# EAGLE design sensor (EAGLE 9.0.1)
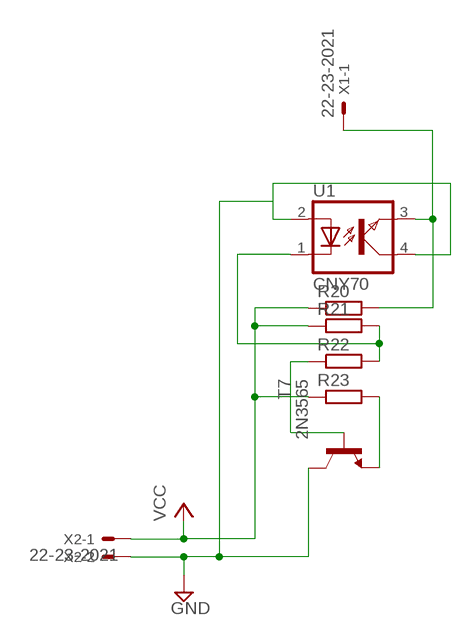
[diagram p0: schematic, sheet 1]

## Parts
R20  R-EU_0204/7  [0204/7]
R21  R-EU_0204/7  [0204/7]
R22  R-EU_0204/7  [0204/7]
R23  R-EU_0204/7  [0204/7]
T7  2N3565  [TO92]
U1  CNY70  [CNY70]
X1  22-23-2021  [22-23-2021]
X2  22-23-2021  [22-23-2021]

## Nets
GND1: T7.1(C) U1.2 U1.4 X2.2
N$1: R23.2 T7.3(E)
N$6: R21.2 R22.2 U1.1
N$8: R20.2 U1.3 X1.1
N$9: R22.1 T7.2(B)
VCC: R20.1 R21.1 R23.1 X2.1
Unconnected: X1.2

## Library data of the parts
R20-R23 = rcl:R-EU_: RESISTOR, European symbol; SPICEPREFIX: R
T7 = transistor:2N3565: NPN TRANSISTOR
U1 = E&R_Sensores:CNY70: Sensor infrarrojo CNY70
X1 X2 = con-molex:22-23-2021: .100" (2.54mm) Center Header - 2 Pin; MF: MOLEX; MPN: 22-23-2021; OC_FARNELL: 1462926; OC_NEWARK: 25C3832

## Board
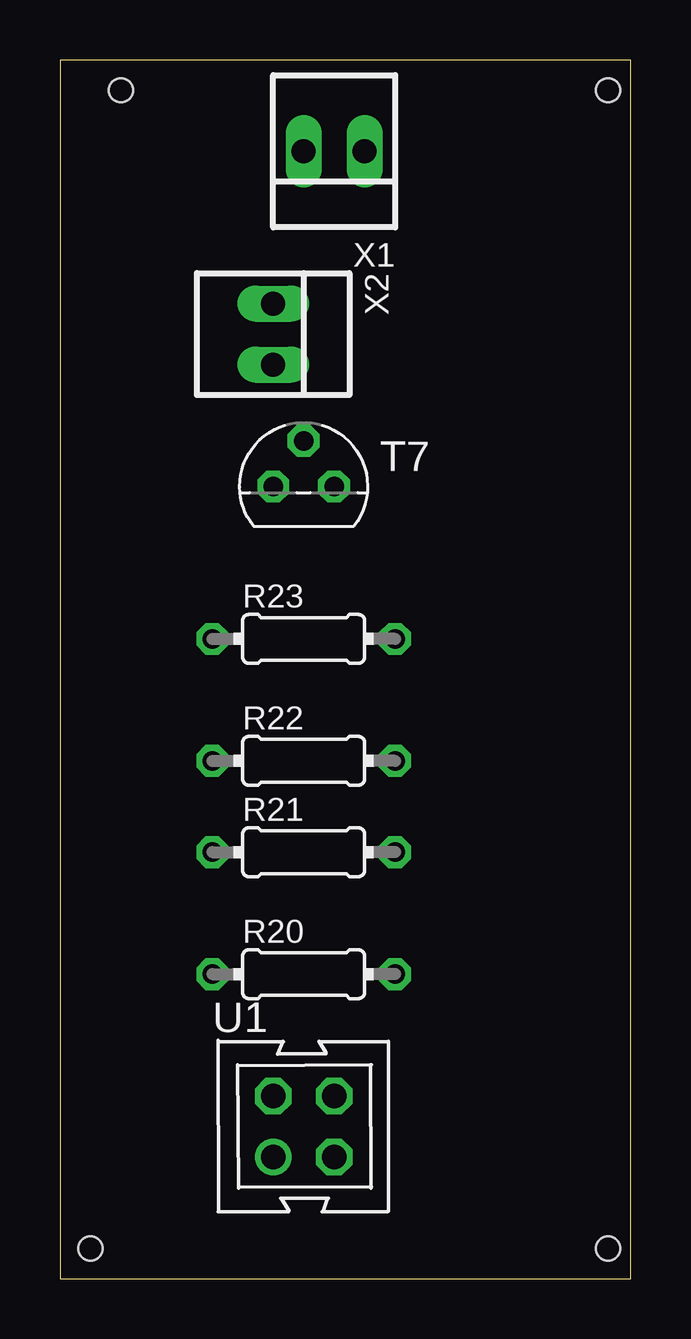
[diagram p1: board, top side]
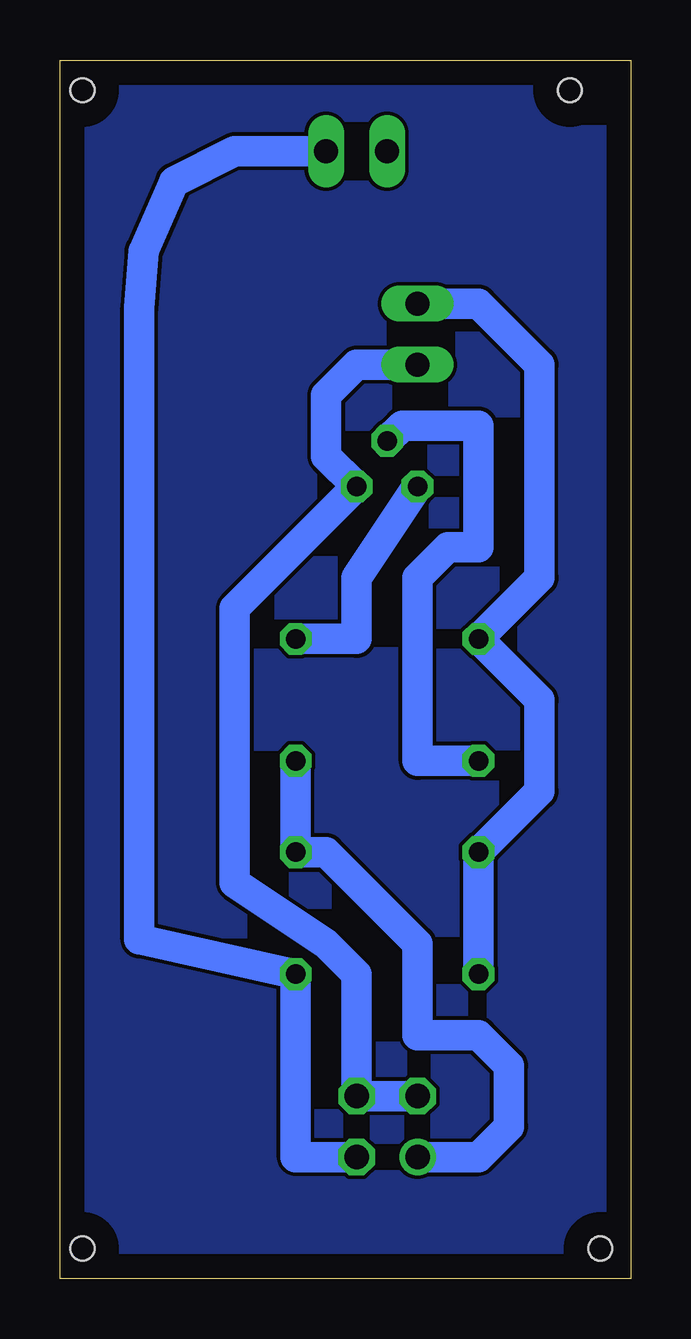
[diagram p2: board, bottom side, seen from below]

Size 23.8 x 50.79 mm. Coordinates in mm from the lower left corner, seen from the top.
Outline: 0,0 23.8,0 23.8,50.79 0,50.79 0,0
Copper layers (1*16): Top 0.035mm / dielectric 1.5mm / Bottom 0.035mm
Design rules "default": minimum track width 6mil, minimum drill 0.35mm, track to track 6mil, track to pad 6mil, pad to pad 6mil, via to via 6mil, smd to smd 6mil, copper to edge 40mil, drill to drill 6mil, minimum pad ring 10mil, minimum via ring 8mil, stop-mask expansion 4mil, vias tented up to drill 0mil, thermal gap 10mil
Holes 1 mm at 2.54,49.53 22.86,49.53 22.86,1.27 1.27,1.27

### Footprints (pad centres in the part's own frame; a part is rotated, then mirrored left to right if it is on the bottom)
0204/7 = drill 0.813 octagon: 1 -3.81,0; 2 3.81,0
TO92 = drill 0.813 octagon: 1 1.27,0; 2 0,1.905; 3 -1.27,0
CNY70 = drill 1.016: 1 -2.54,-1.27 | drill 1.016 octagon: 2 -2.54,1.27; 3 0,-1.27; 4 0,1.27
22-23-2021 = drill 1 long: 1 -1.27,0; 2 1.27,0

### Placement (x,y rotation side)
R20  10.16,12.7 0 top
R21  10.16,17.78 0 top
R22  10.16,21.59 0 top
R23  10.16,26.67 0 top
T7  10.16,33.02 0 top
U1  11.43,6.35 0 top
X1  11.43,46.99 180 top
X2  8.89,39.37 270 top

### Tracks (layer width: path | path; a pad name or v marks a point on that pad's centre or on a via)
GND1
  Bottom 1.27: U1.2 U1.4 11.43,12.7 12.7,13.97 16.51,16.51 16.51,27.94 T7.1 12.7,34.29 12.7,36.83 11.43,38.1 X2.2
N$1
  Bottom 1.27: T7.3 11.43,29.21 11.43,26.67 R23.2
N$3
  pour Bottom: 0,0 0,50.8 24.13,50.8 24.13,0
N$6
  Bottom 1.27: U1.1 6.35,5.08 5.08,6.35 5.08,8.89 6.35,10.16 8.89,10.16 8.89,13.97 12.7,17.78 R21.2 R22.2
N$8
  Bottom 1.27: U1.3 13.97,5.08 R20.2 20.5,14.15 20.5,40.46 20.32,42.82 19.05,45.72 16.51,46.99 X1.1
N$9
  Bottom 1.27: R22.1 8.89,21.59 8.89,29.21 7.62,30.48 6.35,30.48 6.35,35.56 9.53,35.56 T7.2
VCC
  Bottom 1.27: X2.1 6.35,40.64 3.81,38.1 3.81,29.21 R23.1 3.81,24.13 3.81,20.32 R21.1 R20.1